# EAGLE schematic FTIR_v0.1_noCC2 (EAGLE 7.1.0)
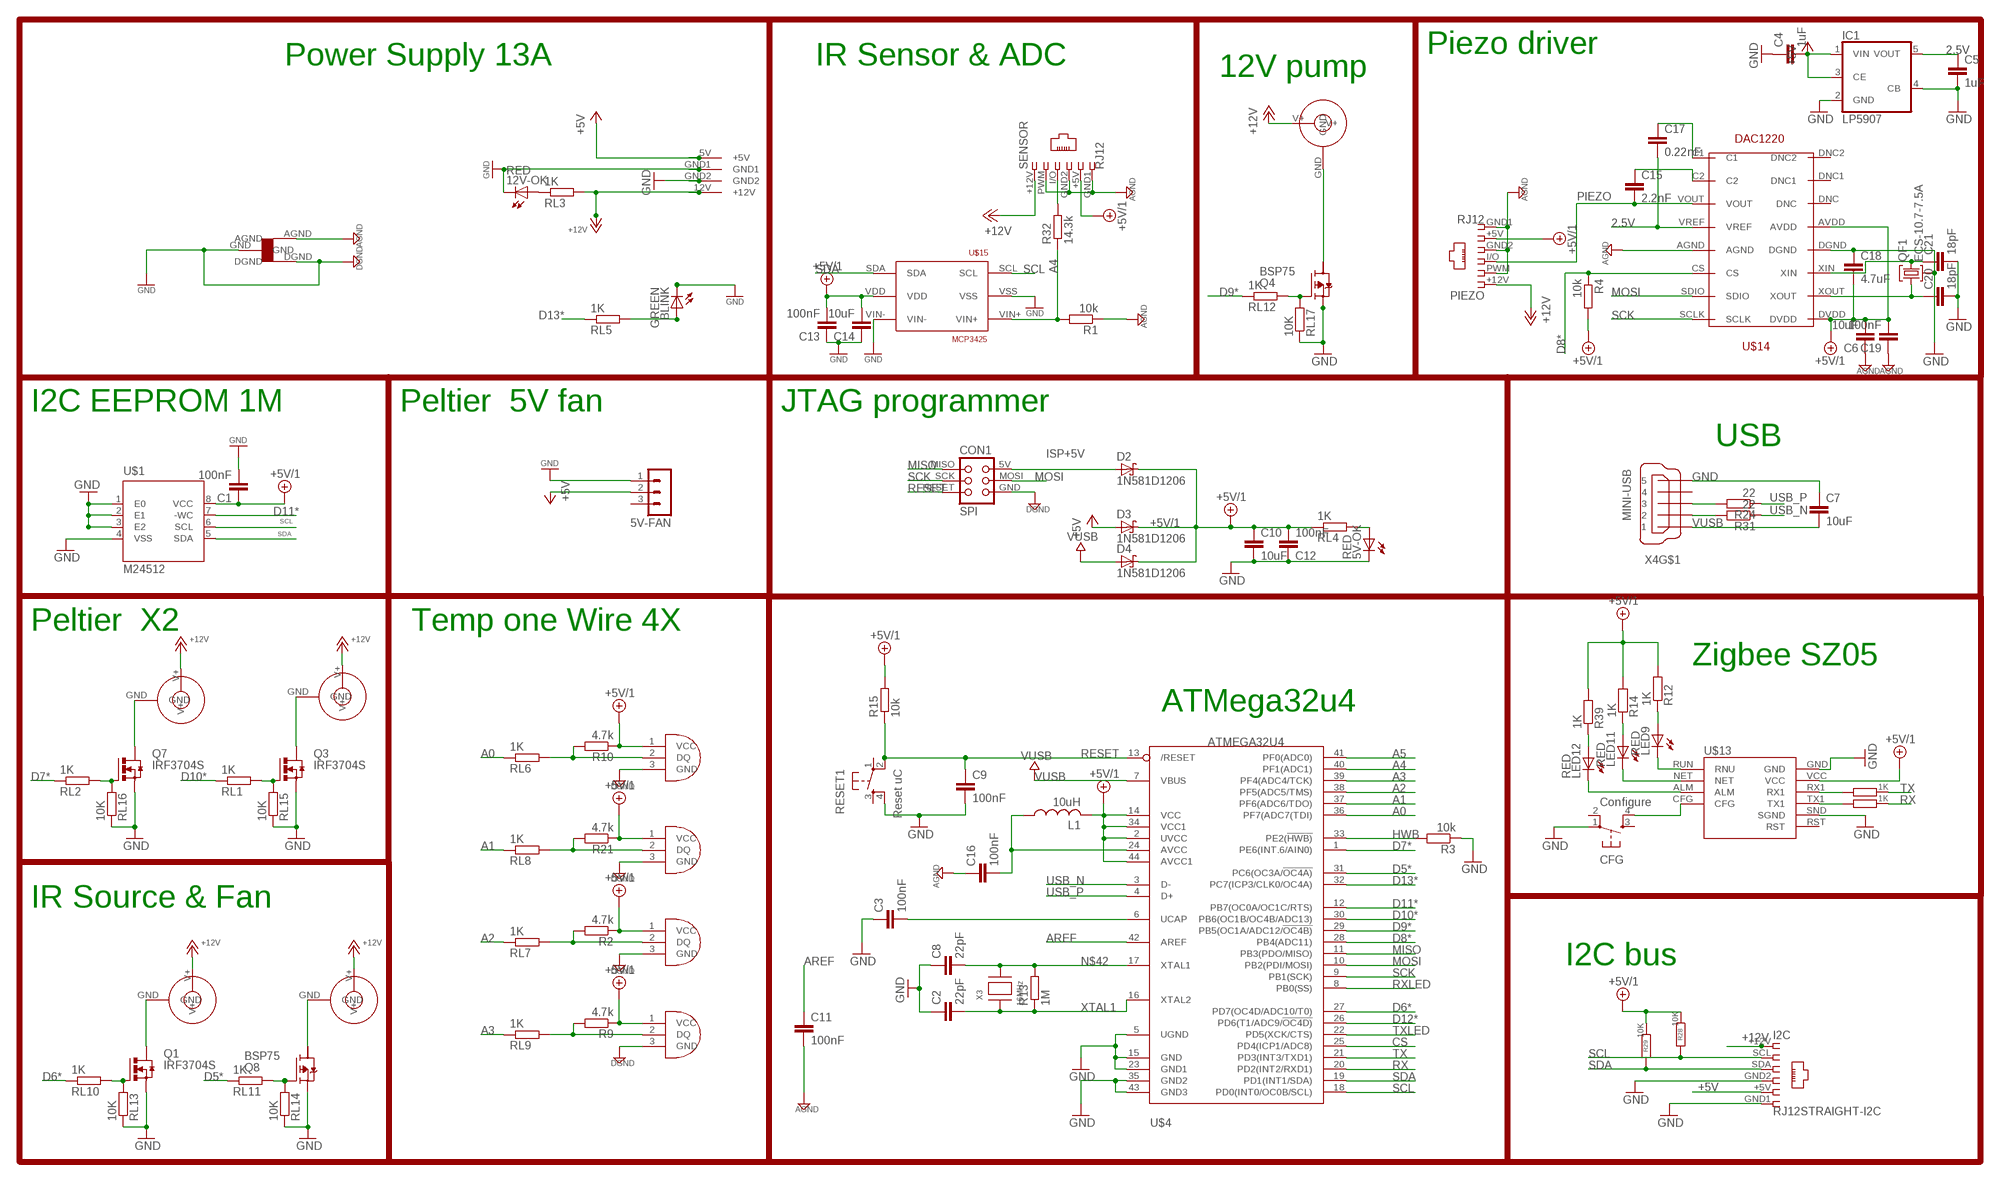
[diagram p0: schematic, sheet 1, part 1 of 2]
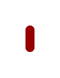
[diagram p1: schematic, sheet 1, part 2 of 2]

## Parts
5V-FAN  MA03-1  [MA03-1]
5V-OK  RED  LEDCHIPLED_1206  [CHIPLED_1206]
12V-OK  RED  LEDCHIPLED_1206  [CHIPLED_1206]
BLINK  GREEN  LEDCHIPLED_1206  [CHIPLED_1206]
C1  100nF  C-EUC1206  [C1206]
C2  22pF  C-EUC1206  [C1206]
C3  100nF  C-EUC1206  [C1206]
C4  1uF  C-EUC1206  [C1206]
C5  1uF  C-EUC1206  [C1206]
C6  10uF  C-EUC1206  [C1206]
C7  10uF  C-EUC1206  [C1206]
C8  22pF  C-EUC1206  [C1206]
C9  100nF  C-EUC1206  [C1206]
C10  10uF  C-EUC1206  [C1206]
C11  100nF  C-EUC1206  [C1206]
C12  100nF  C-EUC1206  [C1206]
C13  100nF  C-EUC1206  [C1206]
C14  10uF  C-EUC1206  [C1206]
C15  2.2nF  C-EUC1206  [C1206]
C16  100nF  C-EUC1206  [C1206]
C17  0.22nF  C-EUC1206  [C1206]
C18  4.7uF  C-EUC1206  [C1206]
C19  100nF  C-EUC1206  [C1206]
C20  18pF  C-EUC1206  [C1206]
C21  18pF  C-EUC1206  [C1206]
CFG  Configure  TAC_SWITCHSMD  [TACTILE_SWITCH_SMD]
CON1  SPI  TINYISPT  [TC2030-MCP-NL]
D2  1N581D1206  [LED-1206]
D3  1N581D1206  [LED-1206]
D4  1N581D1206  [LED-1206]
I2C  RJ12STRAIGHT-I2C  [RJ12-STRAIGHT-I2C]
IC1  LP5907  TS520525  [SOT25]
L1  10uH  L-USL2012C  [L2012C]
LED9  RED  LEDCHIPLED_1206  [CHIPLED_1206]
LED11  RED  LEDCHIPLED_1206  [CHIPLED_1206]
LED12  RED  LEDCHIPLED_1206  [CHIPLED_1206]
PIEZO  RJ12  RJ12STRAIGHT  [RJ12-STRAIGHT]
Q1  IRF3704S  [D2PACK]
Q3  IRF3704S  [D2PACK]
Q4  BSP75  BSP613P  [PG-SOT-223]
Q7  IRF3704S  [D2PACK]
Q8  BSP75  BSP613P  [PG-SOT-223]
QF1  ECS-10.7-7.5A  [HC49U]
R1  10k  R-EU_R0805  [R0805]
R2  4.7k  R-EU_R1206  [R1206]
R3  10k  R-EU_M0805  [M0805]
R4  10k  R-EU_R0805  [R0805]
R8  1K  R-EU_R0805  [R0805]
R9  4.7k  R-EU_R1206  [R1206]
R10  4.7k  R-EU_R1206  [R1206]
R11  1K  R-EU_R0805  [R0805]
R12  1K  R-EU_R0805  [R0805]
R13  1M  R-EU_R1206  [R1206]
R14  1K  R-EU_R0805  [R0805]
R15  10k  R-EU_M0805  [M0805]
R21  4.7k  R-EU_R1206  [R1206]
R24  22  R-EU_M1206  [M1206]
R28  10K  R-EU_M0805  [M0805]
R29  10K  R-EU_M0805  [M0805]
R31  22  R-EU_M1206  [M1206]
R32  14.3k  R-EU_R0805  [R0805]
R39  1K  R-EU_R0805  [R0805]
RESET1  Reset uC  TAC_SWITCHSMD  [TACTILE_SWITCH_SMD]
RL1  1K  R-EU_R0805  [R0805]
RL2  1K  R-EU_R0805  [R0805]
RL3  1K  R-EU_R0805  [R0805]
RL4  1K  R-EU_R0805  [R0805]
RL5  1K  R-EU_R0805  [R0805]
RL6  1K  R-EU_R0805  [R0805]
RL7  1K  R-EU_R0805  [R0805]
RL8  1K  R-EU_R0805  [R0805]
RL9  1K  R-EU_R0805  [R0805]
RL10  1K  R-EU_R0805  [R0805]
RL11  1K  R-EU_R0805  [R0805]
RL12  1K  R-EU_R0805  [R0805]
RL13  10K  R-EU_R0805  [R0805]
RL14  10K  R-EU_R0805  [R0805]
RL15  10K  R-EU_R0805  [R0805]
RL16  10K  R-EU_R0805  [R0805]
RL17  10K  R-EU_R0805  [R0805]
SENSOR  RJ12  RJ12STRAIGHT  [RJ12-STRAIGHT]
U$1  M24512  [SO8]
U$3  AMP_MATE_N_LOCK  [AMP_MATE_N_LOCK]
U$4  ATMEGA32U4  ATMEGA32U4-AU  [TQFP44]
U$5  STARGND  [STAR]
U$6  JACK_PJ-063BH  [PJ-063BH]
U$9  DS18B20_PINS  [3PINS_SMALL]
U$10  DS18B20_PINS  [3PINS_SMALL]
U$11  DS18B20_PINS  [3PINS_SMALL]
U$12  DS18B20_PINS  [3PINS_SMALL]
U$13  SZ05-ZIGBEESMD  [SZ05-ZIGBEE3]
U$14  DAC1220  [SSOP-16]
U$15  MCP3425  [SOT-23-6]
U$16  JACK_PJ-063BH  [PJ-063BH]
U$17  JACK_PJ-063BH  [PJ-063BH]
U$18  JACK_PJ-063BH  [PJ-063BH]
U$19  JACK_PJ-063BH  [PJ-063BH]
X3  16MHz  XTALNX6035  [NX6035]
X4  MINI-USB  MINI-USB-SCHIELD-32005-201  [32005-201]

## Nets
2.5V: C5.1 C17.2 IC1.5(VOUT) U$14.VREF
+5V [power]: 5V-FAN.2 C4.2 D3.A I2C.+5V IC1.1(VIN) IC1.3(CE) U$3.5V(+5V)
+5V/1 [fine]: C1.1 C6.2 C10.1 C12.2 C13.2 C14.2 C18.2 C19.2 D2.C D3.C D4.C L1.2 PIEZO.+5V R2.1 R4.2 R9.1 R10.1 R12.2 R14.2 R15.2 R21.1 R28.1 R29.1 R39.2 RL4.1 SENSOR.+5V U$1.8(VCC) U$4.2(UVCC) U$4.14(VCC) U$4.34(VCC1) U$4.44(AVCC1) U$9.1(VCC) U$10.1(VCC) U$11.1(VCC) U$12.1(VCC) U$13.VCC U$14.AVDD U$14.DVDD U$15.VDD
+12V [power]: I2C.+12V PIEZO.+12V RL3.2 SENSOR.+12V U$3.12V(+12V) U$6.V+ U$16.V+ U$17.V+ U$18.V+ U$19.V+
A0: RL6.1 U$4.36(PF7(ADC7(TDI))
A1: RL8.1 U$4.37(PF6(ADC6/TDO))
A2: RL7.1 U$4.38(PF5(ADC5/TMS))
A3: RL9.1 U$4.39(PF4(ADC4/TCK))
A4: R1.2 R32.1 U$4.40(PF1(ADC1)) U$15.VIN+
A5: U$4.41(PF0(ADC0))
AGND: C6.1 C11.2 C16.1 C19.1 PIEZO.GND1 PIEZO.GND2 PIEZO.PWM R1.1 SENSOR.GND1 SENSOR.GND2 SENSOR.PWM U$5.AGND U$14.AGND
AREF: C11.1 U$4.42(AREF)
CS: U$4.25(PD4(ICP1/ADC8))
D5*: RL11.1 U$4.31(PC6(OC3A/!OC4A))
D6*: RL10.1 U$4.27(PD7(OC4D/ADC10/T0))
D7*: RL2.1 U$4.1(PE6(INT.6/AIN0))
D8*: R4.1 U$4.28(PB4(ADC11)) U$14.CS
D9*: RL12.1 U$4.29(PB5(OC1A/ADC12/!OC4B))
D10*: RL1.1 U$4.30(PB6(OC1B/OC4B/ADC13))
D11*: U$1.7(-WC) U$4.12(PB7(OC0A/OC1C/RTS))
D12*: U$4.26(PD6(T1/ADC9/!OC4D))
D13*: RL5.1 U$4.32(PC7(ICP3/CLK0/OC4A))
GND [power]: 5V-FAN.1 5V-OK.C 12V-OK.C BLINK.C C1.2 C2.1 C3.1 C4.1 C5.2 C7.1 C8.1 C9.2 C10.2 C12.1 C13.1 C14.1 C18.1 C20.2 C21.2 CFG.1 CON1.GND I2C.GND1 I2C.GND2 IC1.2(GND) IC1.4(CB) Q1.3(S) Q3.3(S) Q4.3(S) Q7.3(S) Q8.3(S) QF1.2 R3.1 RESET1.4 RL13.1 RL14.1 RL15.1 RL16.1 RL17.1 U$1.1(E0) U$1.2(E1) U$1.3(E2) U$1.4(VSS) U$3.GND1 U$3.GND2 U$4.5(UGND) U$4.15(GND) U$4.23(GND1) U$4.35(GND2) U$4.43(GND3) U$5.DGND U$5.GND U$9.3(GND) U$10.3(GND) U$11.3(GND) U$12.3(GND) U$13.GND U$13.SND(SGND) U$14.DGND U$15.VIN- U$15.VSS X4.5 ; supply symbol labelled DGND
GND1 [VIN]: LED9.C U$13.RUN(RNU)
GND2 [VIN]: LED11.C U$13.NET
GND3 [VIN]: LED12.C U$13.ALM
HWB: R3.2 U$4.33(PE2(!HWB))
ISP+5V: CON1.5V(VCC) D2.A
MISO: CON1.MISO U$4.11(PB3(PDO/MISO))
MOSI: CON1.MOSI U$4.10(PB2(PDI/MOSI)) U$14.SDIO
N$1: Q4.1(G) RL12.2 RL17.2
N$2: R32.2 SENSOR.I/O
N$3: BLINK.A RL5.2
N$4: Q4.2(D) U$19.GND
N$6: Q7.1(G) RL2.2 RL16.2
N$7: Q1.2(D) U$17.GND
N$9 [power]: R21.2 RL8.2 U$10.2(DQ)
N$11: R11.2 U$13.RX1
N$12: 5V-OK.A RL4.2
N$13: Q3.1(G) RL1.2 RL15.2
N$14 [fine]: C16.2 L1.1 U$4.24(AVCC)
N$15: C15.1 U$14.C2
N$16: C3.2 U$4.6(UCAP)
N$17 [power]: R2.2 RL7.2 U$11.2(DQ)
N$18 [power]: R9.2 RL9.2 U$12.2(DQ)
N$19: C21.1 QF1.3 U$14.XIN
N$21 [power]: R10.2 RL6.2 U$9.2(DQ)
N$22: Q8.2(D) U$18.GND
N$24: R8.2 U$13.TX1
N$25: LED9.A R12.1
N$26: LED11.A R14.1
N$27: LED12.A R39.1
N$28: Q1.1(G) RL10.2 RL13.2
N$29: C17.1 U$14.C1
N$30: Q7.2(D) U$6.GND
N$31: C20.1 QF1.1 U$14.XOUT
N$34: Q3.2(D) U$16.GND
N$35: CFG.4 U$13.CFG
N$37: Q8.1(G) RL11.2 RL14.2
N$42: C8.2 R13.2 U$4.17(XTAL1) X3.P$2
N$75: 12V-OK.A RL3.1
PIEZO: C15.2 PIEZO.I/O U$14.VOUT
RESET: C9.1 CON1.RESET R15.1 RESET1.2 U$4.13(/RESET)
RX: R8.1 U$4.20(PD2(INT2/RXD1))
RXLED: U$4.8(PB0(SS))
SCK: CON1.SCK U$4.9(PB1(SCK)) U$14.SCLK
SCL: I2C.SCL R28.2 U$1.6(SCL) U$4.18(PD0(INT0/OC0B/SCL)) U$15.SCL
SDA: I2C.SDA R29.2 U$1.5(SDA) U$4.19(PD1(INT1/SDA)) U$15.SDA
TX: R11.1 U$4.21(PD3(INT3/TXD1))
TXLED: U$4.22(PD5(XCK/CTS))
USB_N: R31.1 U$4.3(D-)
USB_P: R24.1 U$4.4(D+)
USBC_N: R31.2 X4.2
USBC_P: R24.2 X4.3
VUSB: C7.2 D4.A U$4.7(VBUS) X4.1
XTAL1: C2.2 R13.1 U$4.16(XTAL2) X3.P$1
Unconnected: 5V-FAN.3 CFG.2 CFG.3 Q4.4(D) Q8.4(D) RESET1.1 RESET1.3 U$13.RST U$14.DNC U$14.DNC1 U$14.DNC2 X4.4 X4.M1(S:S1) X4.M2(S:S2) X4.M3(S:S3) X4.M4(S:S4)

## Notes on the sheet
- Piezo driver
- Power Supply 13A | IR Sensor & ADC
- 12V pump
- I2C EEPROM 1M | Peltier  5V fan | JTAG programmer
- USB
- Peltier  X2 | Temp one Wire 4X
- Zigbee SZ05
- ATMega32u4
- IR Source & Fan
- I2C bus

## Library data of the parts
5V-FAN = con-lstb:MA03-1: PIN HEADER; OC_FARNELL: unknown; OC_NEWARK: unknown
5V-OK 12V-OK BLINK LED9 LED11 LED12 = adafruit:LED: LED OSRAM: - CHIPLED LG R971, LG N971, LY N971, LG Q971, LY Q971, LO R971, LY R971 LH N974, LH R974 LS Q976, LO Q976, LY Q976 LO Q996 - Hyper CHIPLED LW Q18S LB Q993, LB Q99A, LB R99A - SideLED LS A670, LO A670, LY A670, LG A670, LP A670 LB A673, LV A673, LT A673, LW A673 LH A674 LY A675 LS A676, LA A676, LO A676, LY A676, LW A676 LS A679, LY A679, LG A679 - Hyper Micro SIDELED® LS Y876, LA Y876, LO Y876, LY Y876 LT Y87S - SmartLED LW L88C, LW L88S LB L89C, LB L89S, LG L890 LS L89K, LO L89K, LY L89K LS L896, LA L896, LO L896, LY L896 - TOPLED LS T670, LO T670, LY T670, LG T670, LP T670 LSG T670, LSP T670, LSY T670, LOP T670, LYG T670 LG T671, LOG T671, LSG T671 LB T673, LV T673, LT T673, LW T673 LH T674 LS T676, LA T676, LO T676, LY T676, LB T676, LH T676, LSB T676, LW T676 LB T67C, LV T67C, LT T67C, LS T67K, LO T67K, LY T67K, LW E67C LS E67B, LA E67B, LO E67B, LY E67B, LB E67C, LV E67C, LT E67C LW T67C LS T679, LY T679, LG T679 LS T770, LO T770, LY T770, LG T770, LP T770 LB T773, LV T773, LT T773, LW T773 LH T774 LS E675, LA E675, LY E675, LS T675 LS T776, LA T776, LO T776, LY T776, LB T776 LHGB T686 LT T68C, LB T68C - Hyper Mini TOPLED® LB M676 - Mini TOPLED Santana® LG M470 LS M47K, LO M47K, LY M47K Source: http://www.osram.convergy.de/
C1-C21 = rcl:C-EU: CAPACITOR, European symbol
CFG RESET1 = lpatiny:TAC_SWITCH: Momentary Switch Button commonly used for reset or general input. Spark Fun Electronics SKU : COM-00097
CON1 = lpatiny:TINYISP: CONNECTOR
D2-D4 = lpatiny:1N581*: 1.0A SCHOTTKY BARRIER RECTIFIER Source: http://www.diodes.com/datasheets/ds23001.pdf
I2C PIEZO SENSOR = lpatiny:RJ12: CORCOM Modular RJ Jacks No Shield Source: www.tycoelectronics.com .. ENG_DS_1654001_1099_RJ_L_0507.pdf
IC1 = v-reg:TS5205: 150mA Low Noise LDO Voltage Regulator with Enable TSC [Taiwan Semiconductor Company, Ltd] Source: http://www.taiwansemi.com .. 5205_0409c.pdf
L1 = rcl:L-US: INDUCTOR, American symbol
Q1 Q3 Q7 = transistor-power:IRF3704: SMPS MOSFET HEXFET® Power MOSFET Source: http://www.irf.com/product-info/datasheets/data/irf3704.pdf
Q4 Q8 = infineon:BSP613P: SIPMOS (R) Small-Signal-Transistor P-Channel (2 Drain) Source: http://www.infineon.com/dgdl/BSP613P_Rev2.4.pdf; OC_FARNELL: unknown; OC_NEWARK: unknown
QF1 = crystal:ECS: MONOLITHIC CRYSTAL FILTERS Source: http://www.presto.co.uk; OC_FARNELL: unknown; OC_NEWARK: unknown
R1 R4 R8 R11-R14 R32 R39 RL1-RL3 RL5-RL17 = rcl:R-EU_: RESISTOR, European symbol
R2 R3 R9 R10 R15 R21 R24 R28 R29 R31 RL4 = resistor:R-EU_: RESISTOR, European symbol
U$1 = lpatiny:M24512
U$3 = lpatiny:AMP_MATE_N_LOCK
U$4 = adafruit:ATMEGA32U4: http://www.ladyada.net/library/eagle
U$5 = lpatiny:STARGND
U$6 U$16-U$19 = lpatiny:JACK_PJ-063BH: PJ-063BH 8A Power Jack
U$9-U$12 = lpatiny:DS18B20_PINS
U$13 = lpatiny:SZ05-ZIGBEE
U$14 = FTIR:DAC1220: 20-Bit, Low-Power Digital-to-Analog Converter
U$15 = phMeter:MCP3425
X3 = lpatiny:XTAL: Low cost SMT crystals, no capacitors included http://www.ladyada.net/library/eagle
X4 = con-cypressindustries:MINI-USB-SCHIELD-: MINI USB-B Conector Source: www.cypressindustries.com; OC_FARNELL: unknown; OC_NEWARK: unknown

## Net classes
0 default: width 0.305 mm, drill 0.254 mm
1 power: width 0.305 mm, drill 0.254 mm
2 VIN: width 0.457 mm
3 fine: width 0.254 mm
4 aref: width 0.305 mm